# EAGLE schematic _voltage5vto3_3_MIC5205 (EAGLE 6.4)
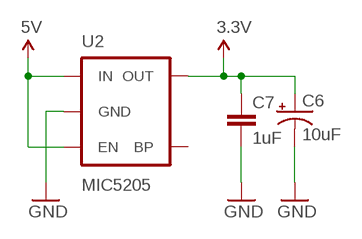
[diagram p0: schematic, sheet 1]

## Parts
C6  10uF  CAP_POL1206  [EIA3216]
C7  1uF  CAP0603-CAP  [0603-CAP]
U2  MIC5205  V_REG_LDOSMD  [SOT23-5]

## Nets
3.3V: C6.A(+) C7.1 U2.5(OUT)
5V: U2.1(IN) U2.3(EN)
GND: C6.C(-) C7.2 U2.2(GND)
Unconnected: U2.4(BP)

## Library data of the parts
C6 = SparkFun:CAP_POL: Capacitor Polarized These are standard SMD and PTH capacitors. Normally 10uF, 47uF, and 100uF in electrolytic and tantalum varieties. Always verify the external diameter of the through hole cap, it varies with capacity, voltage, and manufacturer. The EIA devices should be standard.
C7 = SparkFun:CAP: Capacitor Standard 0603 ceramic capacitor, and 0.1" leaded capacitor.
U2 = SparkFun:V_REG_LDO: Voltage Regulator LDO Standard 150mA LDO voltage regulator in SOT-23 layout. Micrel part MIC5205. BP (by-pass) pin is used to lower output noise with 470pF cap.

## Net classes
0 default: width 0.152 mm, drill 0.305 mm, clearance 0.152 mm